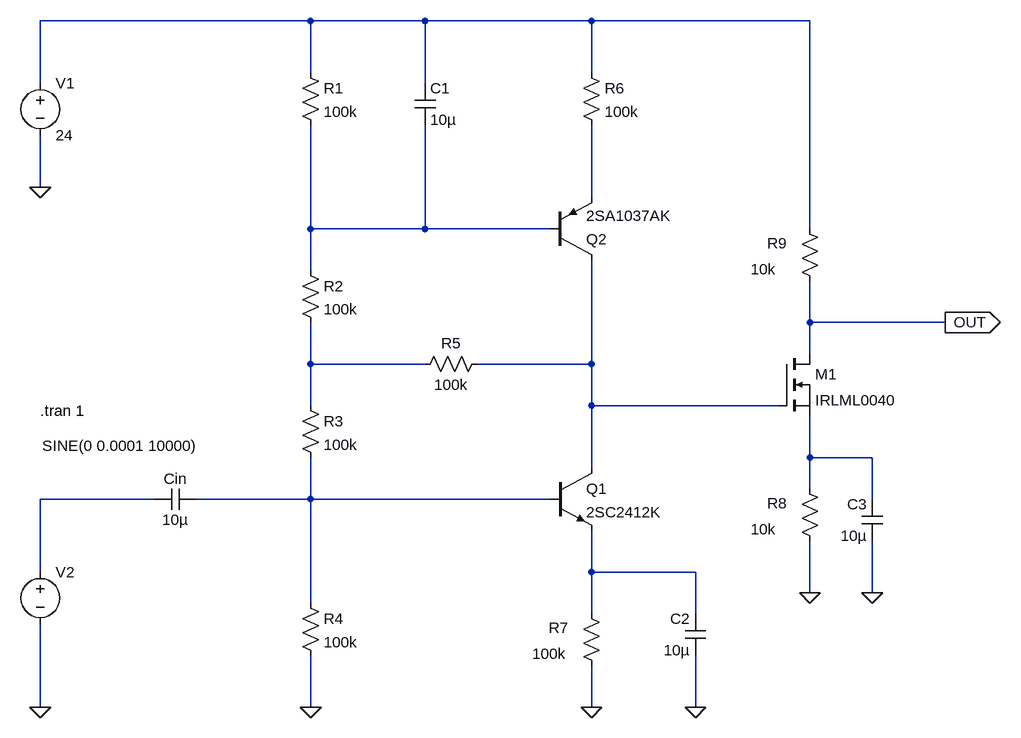
[diagram p0: schematic analog_amp_smp.asc]
analog_amp_smp.asc, the LTspice schematic file:
Version 4
SHEET 1 1708 756
WIRE 208 -416 -208 -416
WIRE 384 -416 208 -416
WIRE 640 -416 384 -416
WIRE 976 -416 640 -416
WIRE 208 -336 208 -416
WIRE 640 -336 640 -416
WIRE -208 -320 -208 -416
WIRE 384 -320 384 -416
WIRE -208 -160 -208 -240
WIRE 640 -144 640 -256
WIRE 208 -96 208 -256
WIRE 384 -96 384 -256
WIRE 384 -96 208 -96
WIRE 576 -96 384 -96
WIRE 976 -96 976 -416
WIRE 208 -32 208 -96
WIRE 976 48 976 -16
WIRE 1184 48 976 48
WIRE 976 96 976 48
WIRE 208 112 208 48
WIRE 384 112 208 112
WIRE 640 112 640 -48
WIRE 640 112 464 112
WIRE 208 176 208 112
WIRE 640 176 640 112
WIRE 928 176 640 176
WIRE 976 256 976 192
WIRE 1072 256 976 256
WIRE 640 272 640 176
WIRE 976 304 976 256
WIRE -32 320 -208 320
WIRE 208 320 208 256
WIRE 208 320 32 320
WIRE 576 320 208 320
WIRE 1072 320 1072 256
WIRE -208 432 -208 320
WIRE 640 432 640 368
WIRE 800 432 640 432
WIRE 976 464 976 384
WIRE 1072 464 1072 384
WIRE 208 480 208 320
WIRE 640 496 640 432
WIRE 800 496 800 432
WIRE -208 640 -208 512
WIRE 208 640 208 560
WIRE 640 640 640 576
WIRE 800 640 800 560
FLAG 640 640 0
FLAG -208 640 0
FLAG -208 -160 0
FLAG 208 640 0
FLAG 800 640 0
FLAG 1184 48 OUT
IOPIN 1184 48 Out
FLAG 976 464 0
FLAG 1072 464 0
SYMBOL npn 576 272 R0
SYMATTR InstName Q1
SYMATTR Value 2SC2412K
SYMBOL pnp 576 -48 M180
SYMATTR InstName Q2
SYMATTR Value 2SA1037AK
SYMBOL res 624 -352 R0
SYMATTR InstName R6
SYMATTR Value 100k
SYMBOL res 624 480 R0
WINDOW 0 -50 38 Left 2
WINDOW 3 -75 78 Left 2
SYMATTR InstName R7
SYMATTR Value 100k
SYMBOL voltage -208 -336 R0
WINDOW 123 0 0 Left 0
WINDOW 39 0 0 Left 0
SYMATTR InstName V1
SYMATTR Value 24
SYMBOL voltage -208 416 R0
WINDOW 123 0 0 Left 0
WINDOW 39 0 0 Left 0
WINDOW 3 3 -178 Left 2
SYMATTR InstName V2
SYMATTR Value SINE(0 0.0001 10000)
SYMBOL cap 32 304 R90
WINDOW 0 0 32 VBottom 2
WINDOW 3 32 32 VTop 2
SYMATTR InstName Cin
SYMATTR Value 10µ
SYMBOL cap 816 560 R180
WINDOW 0 24 56 Left 2
WINDOW 3 24 8 Left 2
SYMATTR InstName C2
SYMATTR Value 10µ
SYMBOL res 192 -352 R0
SYMATTR InstName R1
SYMATTR Value 100k
SYMBOL res 192 -48 R0
SYMATTR InstName R2
SYMATTR Value 100k
SYMBOL res 192 464 R0
SYMATTR InstName R4
SYMATTR Value 100k
SYMBOL res 480 96 R90
WINDOW 0 0 56 VBottom 2
WINDOW 3 32 56 VTop 2
SYMATTR InstName R5
SYMATTR Value 100k
SYMBOL res 192 160 R0
SYMATTR InstName R3
SYMATTR Value 100k
SYMBOL cap 368 -320 R0
SYMATTR InstName C1
SYMATTR Value 10µ
SYMBOL res 960 288 R0
WINDOW 0 -50 38 Left 2
WINDOW 3 -75 78 Left 2
SYMATTR InstName R8
SYMATTR Value 10k
SYMBOL nmos 928 96 R0
SYMATTR InstName M1
SYMATTR Value IRLML0040
SYMBOL res 960 -112 R0
WINDOW 0 -50 38 Left 2
WINDOW 3 -75 78 Left 2
SYMATTR InstName R9
SYMATTR Value 10k
SYMBOL cap 1088 384 R180
WINDOW 0 24 56 Left 2
WINDOW 3 24 8 Left 2
SYMATTR InstName C3
SYMATTR Value 10µ
TEXT -208 184 Left 2 !.tran 1

The netlist it stands for:
* analog_amp_smp.asc
Q1 N005 N008 N009 0 2SC2412K
Q2 N005 N003 N002 0 2SA1037AK
R6 N001 N002 100k
R7 N009 0 100k
V1 N001 0 24
V2 N007 0 SINE(0 0.0001 10000)
Cin N008 N007 10µ
C2 0 N009 10µ
R1 N001 N003 100k
R2 N003 N004 100k
R4 N008 0 100k
R5 N005 N004 100k
R3 N004 N008 100k
C1 N001 N003 10µ
R8 N006 0 10k
M1 OUT N005 N006 N006 IRLML0040
R9 N001 OUT 10k
C3 0 N006 10µ
.model NPN NPN
.model PNP PNP
.lib standard.bjt
.model NMOS NMOS
.model PMOS PMOS
.lib standard.mos
.tran 1
.backanno
.end